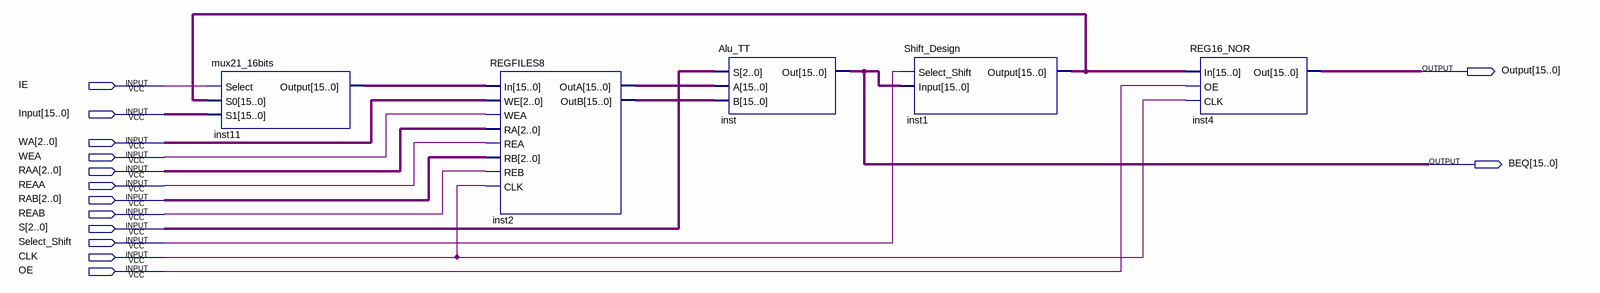
[diagram p0: schematic sheet]
// Quartus schematic Datapath_Design.bdf as structural Verilog: 5 symbols, 14 pins
module Datapath_Design (
  input  IE,
  input  [15:0] Input,
  input  [2:0] WA,
  input  WEA,
  input  [2:0] RAA,
  input  REAA,
  input  [2:0] RAB,
  input  REAB,
  input  [2:0] S,
  input  Select_Shift,
  input  CLK,
  input  OE,
  output [15:0] Output,
  output [15:0] BEQ
);

  wire [15:0] inst1_output, inst2_outa, inst2_outb, inst11_output;

  mux21_16bits inst11 (.Select(IE), .S0(inst1_output), .S1(Input), .Output(inst11_output));
  REGFILES8 inst2 (
    .In(inst11_output), .WE(WA), .WEA(WEA), .RA(RAA), .REA(REAA), .RB(RAB), .REB(REAB), .CLK(CLK),
    .OutA(inst2_outa), .OutB(inst2_outb));
  Alu_TT inst (.S(S), .A(inst2_outa), .B(inst2_outb), .Out(BEQ));
  Shift_Design inst1 (.Select_Shift(Select_Shift), .Input(BEQ), .Output(inst1_output));
  REG16_NOR inst4 (.In(inst1_output), .OE(OE), .CLK(CLK), .Out(Output));
endmodule
